# Altium schematic sheet 10_i2c.SchDoc: I2C Bus
size A4; DocumentNumber: 11; SheetNumber: 11; SheetTotal: 11
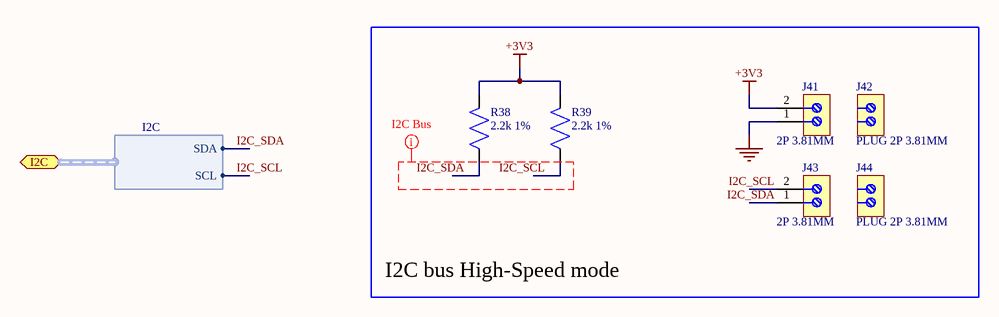
[diagram p0: 10_i2c.SchDoc]

## Parts
J41  2P 3.81MM  [TB-2P-3.81MM]  (no BOM)
J42  PLUG 2P 3.81MM  [TB-PLUG-2P-3.81MM]  (no BOM)
J43  2P 3.81MM  [TB-2P-3.81MM]  (no BOM)
J44  PLUG 2P 3.81MM  [TB-PLUG-2P-3.81MM]  (no BOM)
R38  2.2k 1%  [R0603]
R39  2.2k 1%  [R0603]

## Blocks framed on the sheet
I2C bus High-Speed mode: J41-J44 R38 R39

## Ports
I2C (bidir, harness I2C)

## Harnesses
I2C: SDA, SCL

## Nets
+3V3: J41.2 R38.2 R39.2
GND: J41.1
I2C_SCL: J43.2 R39.1 ; port I2C.SCL
I2C_SDA: J43.1 R38.1 ; port I2C.SDA

## Layout directives
net class I2C: I2C_SCL, I2C_SDA

## Notes on the sheet
- Title
- Size:
- Date:
- A4
- Number:
- Time:
- Revision:
- Sheet
- of
- SmartyBoy
- alkonosst
- github.com/alkonosst <http://github.com/alkonosst>
- Designer:

## Library data of the parts
J41 J43 = TBLOCK-2P-3.81MM: Terminal Block 2 Positions 3.81MM; Category: Connectors: Pluggable System Terminal Block
J42 J44 = PLUG-2P-3.81MM: Terminal block plug 2positions 3.81mm; Category: Connectors: Pluggable System Terminal Block
R38 R39 = 0603WAF2201T5E: ±1% 2.2kΩ ±100ppm/℃ 0.1W 0603 Chip Resistor - Surface Mount; LCSC part: C4190; Category: Resistors: Chip Resistor - Surface Mount